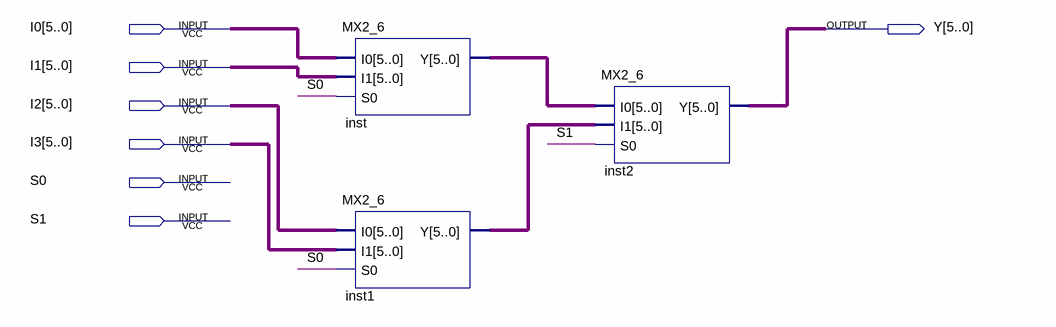
[diagram p0: schematic sheet]
// Quartus schematic MX4_6.bdf as structural Verilog: 3 symbols, 7 pins
module MX4_6 (
  input  [5:0] I0,
  input  [5:0] I1,
  input  [5:0] I2,
  input  [5:0] I3,
  input  S0,
  input  S1,
  output [5:0] Y
);

  wire [5:0] inst1_y, inst_y;

  MX2_6 inst (.I0(I0), .I1(I1), .S0(S0), .Y(inst_y));
  MX2_6 inst1 (.I0(I2), .I1(I3), .S0(S0), .Y(inst1_y));
  MX2_6 inst2 (.I0(inst_y), .I1(inst1_y), .S0(S1), .Y(Y));
endmodule
